# EAGLE design pov (EAGLE 5.10)
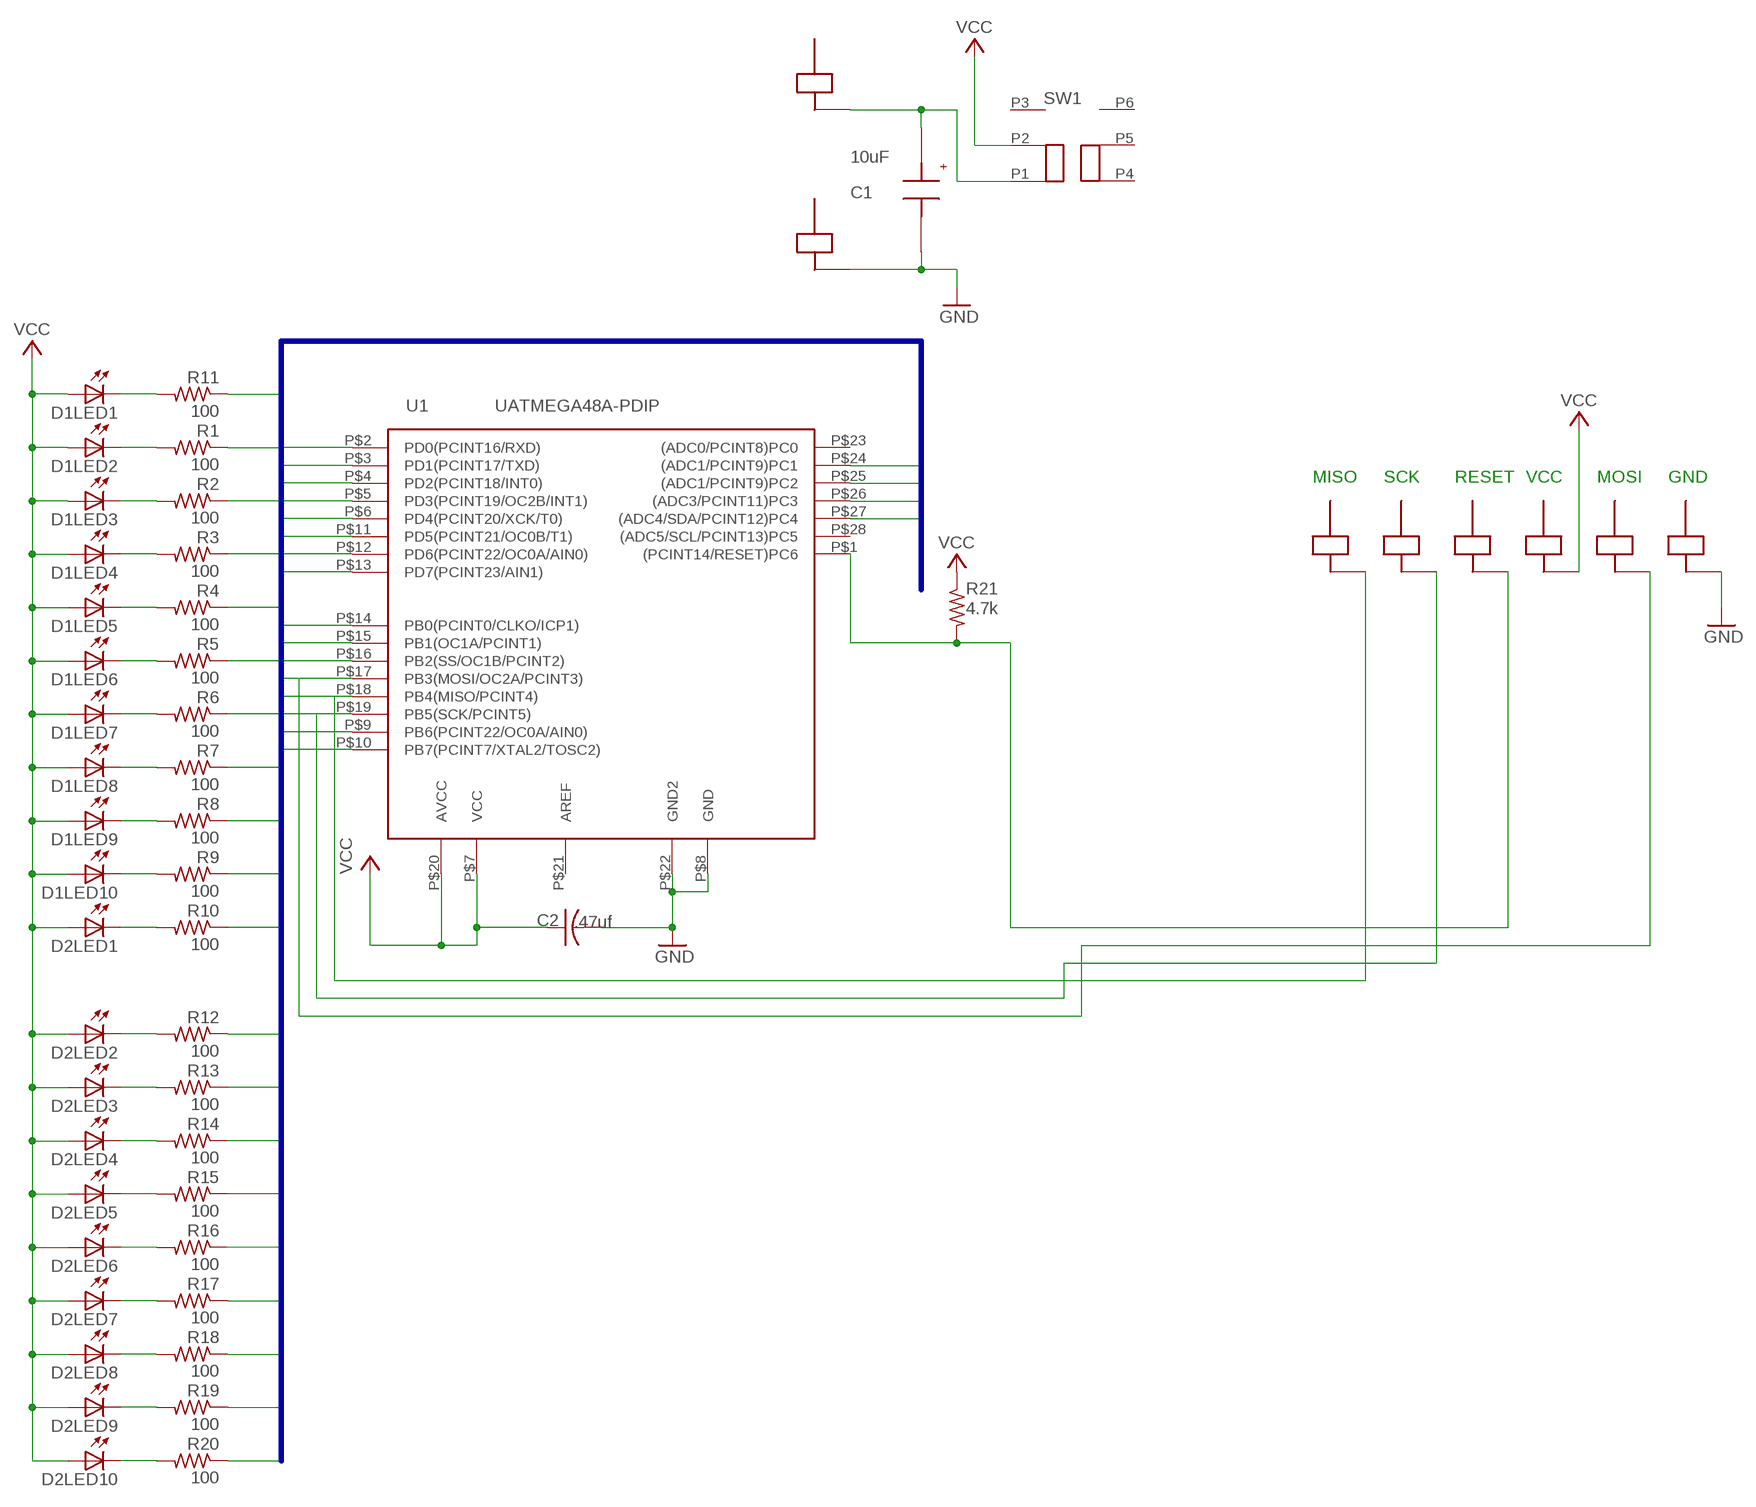
[diagram p0: schematic, sheet 1]

## Parts
C1  10uF  SIDEWAYSCAP  [SIDEWAYSCAP]
C2  .47uf  C-US050-055X075  [C050-055X075]
D1  DBARGRAPH-LED  [PDIP-20]
D2  DBARGRAPH-LED  [PDIP-20]
J2  JHEADER-SINGLE-90  [TSW-150SINGLEBRACKET]
J3  JHEADER-SINGLE-90  [TSW-150SINGLEBRACKET]
J4  JHEADER-SINGLE-90  [TSW-150SINGLEBRACKET]
J5  JHEADER-SINGLE-90  [TSW-150SINGLEBRACKET]
J6  JHEADER-SINGLE-90  [TSW-150SINGLEBRACKET]
J7  JHEADER-SINGLE-90  [TSW-150SINGLEBRACKET]
J8  JHEADER-SINGLE-90  [TSW-150SINGLEBRACKET]
J9  JHEADER-SINGLE-90  [TSW-150SINGLEBRACKET]
R1  100  R-US_0207/2V  [0207/2V]
R2  100  R-US_0207/2V  [0207/2V]
R3  100  R-US_0207/2V  [0207/2V]
R4  100  R-US_0207/2V  [0207/2V]
R5  100  R-US_0207/2V  [0207/2V]
R6  100  R-US_0207/2V  [0207/2V]
R7  100  R-US_0207/2V  [0207/2V]
R8  100  R-US_0207/2V  [0207/2V]
R9  100  R-US_0207/2V  [0207/2V]
R10  100  R-US_0207/2V  [0207/2V]
R11  100  R-US_0207/2V  [0207/2V]
R12  100  R-US_0207/2V  [0207/2V]
R13  100  R-US_0207/2V  [0207/2V]
R14  100  R-US_0207/2V  [0207/2V]
R15  100  R-US_0207/2V  [0207/2V]
R16  100  R-US_0207/2V  [0207/2V]
R17  100  R-US_0207/2V  [0207/2V]
R18  100  R-US_0207/2V  [0207/2V]
R19  100  R-US_0207/2V  [0207/2V]
R20  100  R-US_0207/2V  [0207/2V]
R21  4.7k  R-US_0207/2V  [0207/2V]
SW1  SWITCH-DPDT-OS202013MT5QN1  [0S202013MT5QN1SWITCH]
U1  UATMEGA48A-PDIP  [PDIP-28]

## Nets
GND: C1.P$2(P2) C2.2 J3.P$2 J9.P$2 U1.P$8(GND) U1.P$22(GND2)
LEDS0: R11.1 U1.P$15(PB1(OC1A/PCINT1))
LEDS1: R1.1 U1.P$16(PB2(SS/OC1B/PCINT2))
LEDS2: J8.P$2 R2.1 U1.P$17(PB3(MOSI/OC2A/PCINT3))
LEDS3: J4.P$2 R3.1 U1.P$18(PB4(MISO/PCINT4))
LEDS4: J5.P$2 R4.1 U1.P$19(PB5(SCK/PCINT5))
LEDS5: R5.1 U1.P$14(PB0(PCINT0/CLKO/ICP1))
LEDS6: R6.1 U1.P$13(PD7(PCINT23/AIN1))
LEDS7: R7.1 U1.P$12(PD6(PCINT22/OC0A/AIN0))
LEDS9: R8.1 U1.P$11(PD5(PCINT21/OC0B/T1))
LEDS10: R9.1 U1.P$10(PB7(PCINT7/XTAL2/TOSC2))
LEDS11: R10.1 U1.P$9(PB6(PCINT22/OC0A/AIN0))
LEDS12: R12.1 U1.P$6(PD4(PCINT20/XCK/T0))
LEDS13: R13.1 U1.P$5(PD3(PCINT19/OC2B/INT1))
LEDS14: R14.1 U1.P$4(PD2(PCINT18/INT0))
LEDS15: R15.1 U1.P$3(PD1(PCINT17/TXD))
LEDS16: R16.1 U1.P$2(PD0(PCINT16/RXD))
LEDS17: R17.1 U1.P$24((ADC1/PCINT9)PC1)
LEDS18: R18.1 U1.P$25((ADC1/PCINT9)PC2)
LEDS19: R19.1 U1.P$26((ADC3/PCINT11)PC3)
LEDS20: R20.1 U1.P$27((ADC4/SDA/PCINT12)PC4)
N$1: D2.P$11(LED1:C) R10.2
N$2: D1.P$11(LED1:C) R11.2
N$3: D1.P$12(LED2:C) R1.2
N$4: D1.P$13(LED3:C) R2.2
N$5: D1.P$14(LED4:C) R3.2
N$6: D1.P$15(LED5:C) R4.2
N$7: D1.P$16(LED6:C) R5.2
N$8: D1.P$17(LED7:C) R6.2
N$9: D1.P$18(LED8:C) R7.2
N$10: D1.P$19(LED9:C) R8.2
N$11: D1.P$20(LED10:C) R9.2
N$12: D2.P$12(LED2:C) R12.2
N$13: D2.P$13(LED3:C) R13.2
N$14: D2.P$14(LED4:C) R14.2
N$15: D2.P$15(LED5:C) R15.2
N$16: D2.P$16(LED6:C) R16.2
N$17: D2.P$17(LED7:C) R17.2
N$18: D2.P$18(LED8:C) R18.2
N$19: D2.P$19(LED9:C) R19.2
N$20: D2.P$20(LED10:C) R20.2
N$22: C1.P$1(P1) J2.P$2 SW1.P1
N$29: J6.P$2 R21.2 U1.P$1((PCINT14/RESET)PC6)
VCC: C2.1 D1.P$1(LED1:A) D1.P$2(LED2:A) D1.P$3(LED3:A) D1.P$4(LED4:A) D1.P$5(LED5:A) D1.P$6(LED6:A) D1.P$7(LED7:A) D1.P$8(LED8:A) D1.P$9(LED9:A) D1.P$10(LED10:A) D2.P$1(LED1:A) D2.P$2(LED2:A) D2.P$3(LED3:A) D2.P$4(LED4:A) D2.P$5(LED5:A) D2.P$6(LED6:A) D2.P$7(LED7:A) D2.P$8(LED8:A) D2.P$9(LED9:A) D2.P$10(LED10:A) J7.P$2 R21.1 SW1.P2 U1.P$7(VCC) U1.P$20(AVCC)
Unconnected: SW1.P3 SW1.P4 SW1.P5 SW1.P6 U1.P$21(AREF) U1.P$23((ADC0/PCINT8)PC0) U1.P$28((ADC5/SCL/PCINT13)PC5)

## Buses
LEDS[0..20]

## Notes on the sheet
- MISO | SCK | RESET | VCC | MOSI | GND

## Library data of the parts
C1 = ciuffo:SIDEWAYSCAP
C2 = rcl:C-US: CAPACITOR, American symbol
D1 D2 = ciuffo:DBARGRAPH-LED: 10 LED bargraph display red 20 pin pdip package; DIGIKEYPARTNO: generic
J2-J9 = ciuffo:JHEADER-SINGLE-90: 90 degree header .1 inch is actuall a double header (tall); DIGIKEYPARTNO: xxSAM1049-50-NDxx
R1-R21 = rcl:R-US_: RESISTOR, American symbol
SW1 = ciuffo:SWITCH-DPDT-OS202013MT5QN1: DPDT switch through hole; DIGIKEYPARTNO: CKN9547-ND
U1 = ciuffo:UATMEGA48A-PDIP: ATMEGA48 8-bit microcontroller

## Board
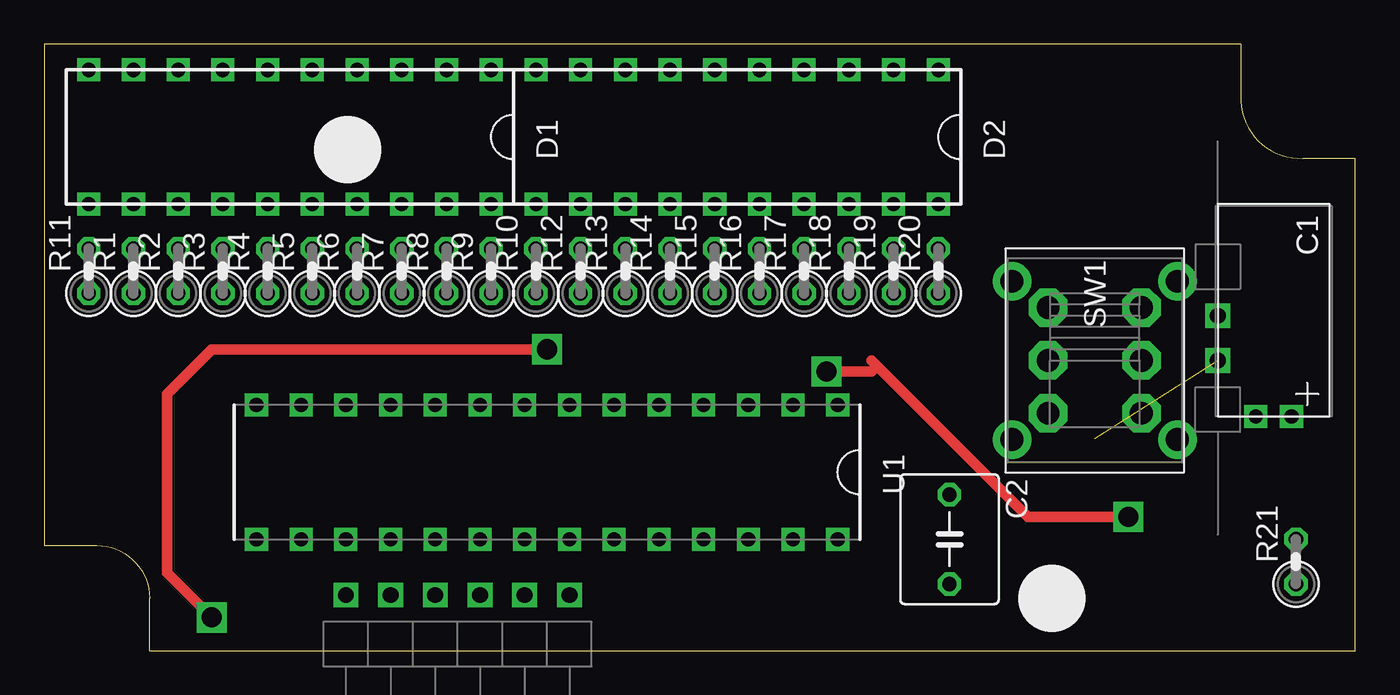
[diagram p1: board, top side]
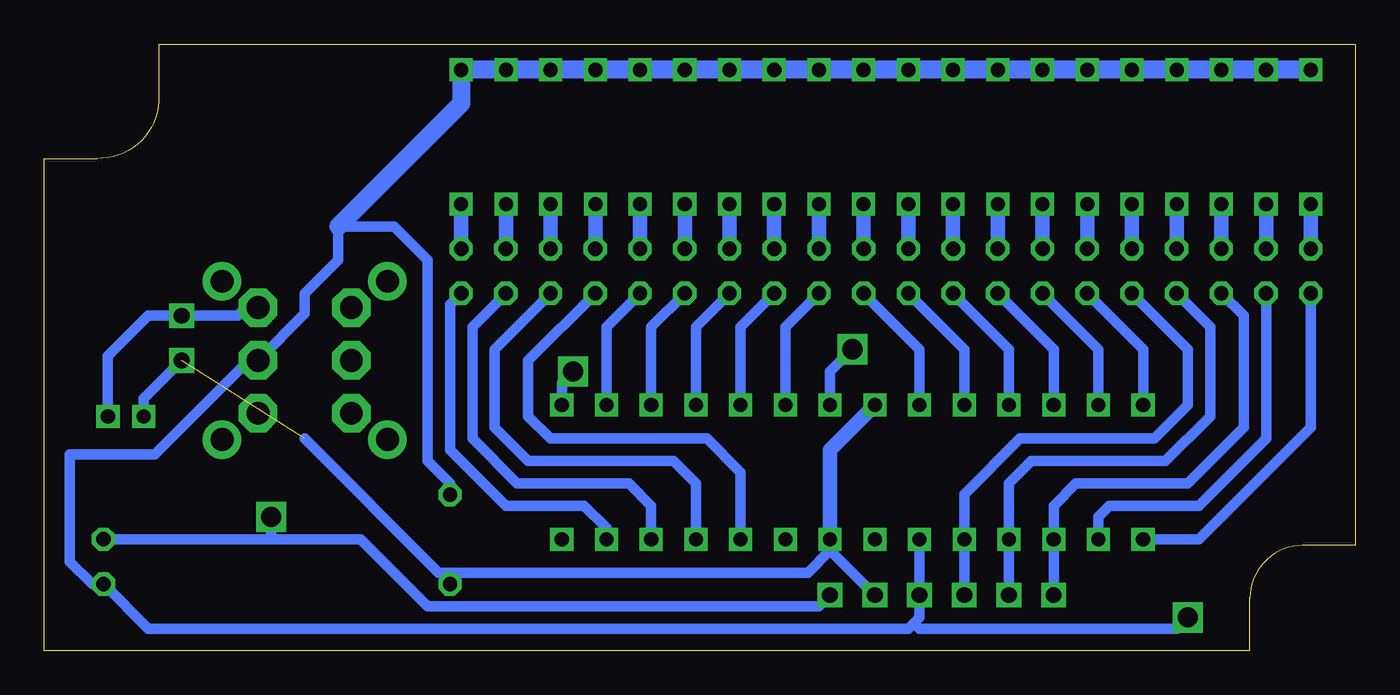
[diagram p2: board, bottom side, seen from below]

Size 74.5 x 34.49 mm. Coordinates in mm from the lower left corner, seen from the top.
Outline: 5.99,0 74.5,0 74.5,27.99 71.5,27.99 arc-90 68,31.24 68,34.49 0,34.49 0,5.99 3,5.99 arc-90 5.99,3 5.99,0
Copper layers (1*16): Top 0.035mm / dielectric 1.5mm / Bottom 0.035mm
Design rules "default": minimum track width 10mil, minimum drill 24mil, track to track 8mil, track to pad 8mil, pad to pad 8mil, via to via 8mil, smd to smd 8mil, copper to edge 40mil, drill to drill 8mil, minimum pad ring 10mil, minimum via ring 8mil, stop-mask expansion 4mil, vias tented up to drill 0mil, thermal gap 10mil

### Footprints (pad centres in the part's own frame; a part is rotated, then mirrored left to right if it is on the bottom)
SIDEWAYSCAP = drill 0.8 square: P$1 0,1.016; P$2 0,-1.016
C050-055X075 = drill 0.813 octagon: 1 -2.54,0; 2 2.54,0
PDIP-20 = drill 0.8 square: P$1 -3.81,13.97; P$2 -3.81,11.43; P$3 -3.81,8.89; P$4 -3.81,6.35; P$5 -3.81,3.81; P$6 -3.81,1.27; P$7 -3.81,-1.27; P$8 -3.81,-3.81; P$9 -3.81,-6.35; P$10 -3.81,-8.89; P$11 3.81,-8.89; P$12 3.81,-6.35; P$13 3.81,-3.81; P$14 3.81,-1.27; P$15 3.81,1.27; P$16 3.81,3.81; P$17 3.81,6.35; P$18 3.81,8.89; P$19 3.81,11.43; P$20 3.81,13.97
TSW-150SINGLEBRACKET = drill 0.9 square: P$2 0,0
0207/2V = drill 0.813 octagon: 1 -1.27,0; 2 1.27,0
0S202013MT5QN1SWITCH = drill 1.3 pad 2.184 octagon: P1 -2.997,2.654; P2 0,2.654; P3 2.997,2.654; P4 -2.997,-2.654; P5 0,-2.654; P6 2.997,-2.654 | drill 1.3 pad 2.184 round: P$7 4.496,4.699; P$8 -4.496,4.699; P$9 4.496,-4.699; P$10 -4.496,-4.699
PDIP-28 = drill 0.8 square: P$1 -8.89,5.08; P$2 -8.89,2.54; P$3 -8.89,0; P$4 -8.89,-2.54; P$5 -8.89,-5.08; P$6 -8.89,-7.62; P$7 -8.89,-10.16; P$8 -8.89,-12.7; P$9 -8.89,-15.24; P$10 -8.89,-17.78; P$11 -8.89,-20.32; P$12 -8.89,-22.86; P$13 -8.89,-25.4; P$14 -8.89,-27.94; P$15 -1.27,-27.94; P$16 -1.27,-25.4; P$17 -1.27,-22.86; P$18 -1.27,-20.32; P$19 -1.27,-17.78; P$20 -1.27,-15.24; P$21 -1.27,-12.7; P$22 -1.27,-10.16; P$23 -1.27,-7.62; P$24 -1.27,-5.08; P$25 -1.27,-2.54; P$26 -1.27,0; P$27 -1.27,2.54; P$28 -1.27,5.08

### Placement (x,y rotation side)
C1  69.85,13.34 270 top
C2  51.44,6.35 270 top
D1  11.43,29.21 270 top
D2  36.83,29.21 270 top
J2  66.67,19.05 0 top
J3  66.67,16.51 180 top
J4  19.68,3.17 180 top
J5  22.23,3.17 180 top
J6  29.84,3.17 180 top
J7  24.77,3.17 180 top
J8  17.14,3.17 180 top
J9  27.3,3.17 180 top
R1  5.08,21.59 90 top
R2  7.62,21.59 90 top
R3  10.16,21.59 90 top
R4  12.7,21.59 90 top
R5  15.24,21.59 90 top
R6  17.78,21.59 90 top
R7  20.32,21.59 90 top
R8  22.86,21.59 90 top
R9  25.4,21.59 90 top
R10  27.94,21.59 90 top
R11  2.54,21.59 90 top
R12  30.48,21.59 90 top
R13  33.02,21.59 90 top
R14  35.56,21.59 90 top
R15  38.1,21.59 90 top
R16  40.64,21.59 90 top
R17  43.18,21.59 90 top
R18  45.72,21.59 90 top
R19  48.26,21.59 90 top
R20  50.8,21.59 90 top
R21  71.12,5.08 90 top
SW1  59.69,16.51 270 top
U1  40.01,5.08 270 top

### Tracks (layer width: path | path; a pad name or v marks a point on that pad's centre or on a via)
GND  (1 unrouted)
  Bottom 0.61: J9.P$2 29.84,5.71 | 29.84,5.71 U1.P$22 | 29.84,5.71 31.11,4.45 51.44,4.45 | 51.44,4.45 52.07,4.45 59.69,12.06 | 51.44,4.45 C2.2 | J3.P$2 68.83,14.35 C1.P$2
  Bottom 0.813: U1.P$22 29.84,11.43 U1.P$8
LEDS0
  Bottom 0.61: U1.P$15 8.89,6.35 2.54,12.7 R11.1
LEDS1
  Bottom 0.61: U1.P$16 14.61,7.62 13.97,8.26 8.89,8.26 5.08,12.06 R1.1
LEDS2
  Bottom 0.61: R2.1 6.35,19.05 6.35,12.7 9.53,9.53 15.88,9.53 17.14,8.26 U1.P$17 J8.P$2
LEDS3
  Bottom 0.61: R3.1 8.26,18.41 8.26,13.34 10.79,10.79 18.41,10.79 19.68,9.53 U1.P$18 J4.P$2
LEDS4
  Bottom 0.61: R4.1 9.53,17.14 9.53,13.97 11.43,12.06 19.05,12.06 22.23,8.89 U1.P$19 J5.P$2
LEDS5
  Bottom 0.61: U1.P$14 12.06,17.14 R5.1
LEDS6
  Bottom 0.61: U1.P$13 14.61,17.14 R6.1
LEDS7
  Bottom 0.61: U1.P$12 17.14,17.14 R7.1
LEDS9
  Bottom 0.61: U1.P$11 19.68,17.14 R8.1
LEDS10
  Bottom 0.61: U1.P$10 22.23,17.14 R9.1
LEDS11
  Bottom 0.61: U1.P$9 24.77,17.14 R10.1
LEDS12
  Bottom 0.61: U1.P$6 32.38,18.41 R12.1
LEDS13
  Bottom 0.61: U1.P$5 34.92,18.41 R13.1
LEDS14
  Bottom 0.61: U1.P$4 37.47,18.41 R14.1
LEDS15
  Bottom 0.61: U1.P$3 40.01,18.41 R15.1
LEDS16
  Bottom 0.61: U1.P$2 42.55,18.41 R16.1
LEDS17
  Bottom 0.61: U1.P$24 34.92,10.16 36.83,12.06 45.72,12.06 46.99,13.34 46.99,16.51 R17.1
LEDS18
  Bottom 0.61: U1.P$25 37.47,9.53 38.73,10.79 46.99,10.79 48.9,12.7 48.9,17.14 R18.1
LEDS19
  Bottom 0.61: U1.P$26 40.01,8.26 41.27,9.53 47.62,9.53 50.16,12.06 50.16,18.41 R19.1
LEDS20
  Bottom 0.61: U1.P$27 42.55,6.99 43.81,8.26 48.26,8.26 51.44,11.43 51.44,19.68 R20.1
N$1
  Bottom 0.813: R10.2 D2.P$11
N$2
  Bottom 0.813: R11.2 D1.P$11
N$3
  Bottom 0.813: R1.2 D1.P$12
N$4
  Bottom 0.813: R2.2 D1.P$13
N$5
  Bottom 0.813: R3.2 D1.P$14
N$6
  Bottom 0.813: R4.2 D1.P$15
N$7
  Bottom 0.813: R5.2 D1.P$16
N$8
  Bottom 0.813: R6.2 D1.P$17
N$9
  Bottom 0.813: R7.2 D1.P$18
N$10
  Bottom 0.813: R8.2 D1.P$19
N$11
  Bottom 0.813: R9.2 D1.P$20
N$12
  Bottom 0.813: R12.2 D2.P$12
N$13
  Bottom 0.813: R13.2 D2.P$13
N$14
  Bottom 0.813: R14.2 D2.P$14
N$15
  Bottom 0.813: R15.2 D2.P$15
N$16
  Bottom 0.813: R16.2 D2.P$16
N$17
  Bottom 0.813: R17.2 D2.P$17
N$18
  Bottom 0.813: R18.2 D2.P$18
N$19
  Bottom 0.813: R19.2 D2.P$19
N$20
  Bottom 0.813: R20.2 D2.P$20
N$22
  Bottom 0.61: SW1.P1 63.04,19.51 63.5,19.05 J2.P$2 68.58,19.05 70.87,16.76 C1.P$1
N$29  (via drill 1.14)
  Top 0.61: 47.31,16.19 55.88,7.62 v61.59,7.62 | 47.31,16.19 46.99,16.51 | v44.45,15.88 46.99,15.88 47.31,16.19
  Bottom 0.61: 61.59,6.35 56.52,6.35 52.7,2.54 30.48,2.54 J6.P$2 | 61.59,6.35 R21.2 | 61.59,6.35 v61.59,7.62 | U1.P$1 45.09,15.24 v44.45,15.88
VCC  (via drill 1.14)
  Top 0.61: v28.57,17.14 9.53,17.14 6.99,14.61 6.99,4.45 v9.53,1.91
  Bottom 0.61: J7.P$2 U1.P$20 24.77,1.91 25.08,1.59 | C2.1 51.44,9.53 52.7,10.79 52.7,22.23 54.61,24.13 57.78,24.13 57.78,22.23 59.69,20.32 59.69,19.16 SW1.P2 62.87,16.51 68.2,11.18 73.03,11.18 73.03,5.08 71.75,3.81 R21.1 68.58,1.27 25.4,1.27 25.08,1.59 | U1.P$7 29.84,15.88 v28.57,17.14 | v9.53,1.91 10.16,1.27 24.77,1.27 25.08,1.59
  Bottom 1.016: D1.P$10 D1.P$9 D1.P$8 D1.P$7 D1.P$6 D1.P$5 D1.P$4 D1.P$3 D1.P$2 D1.P$1 D2.P$10 D2.P$9 D2.P$8 D2.P$7 D2.P$6 D2.P$5 D2.P$4 D2.P$3 D2.P$2 D2.P$1 50.8,31.11 57.78,24.13